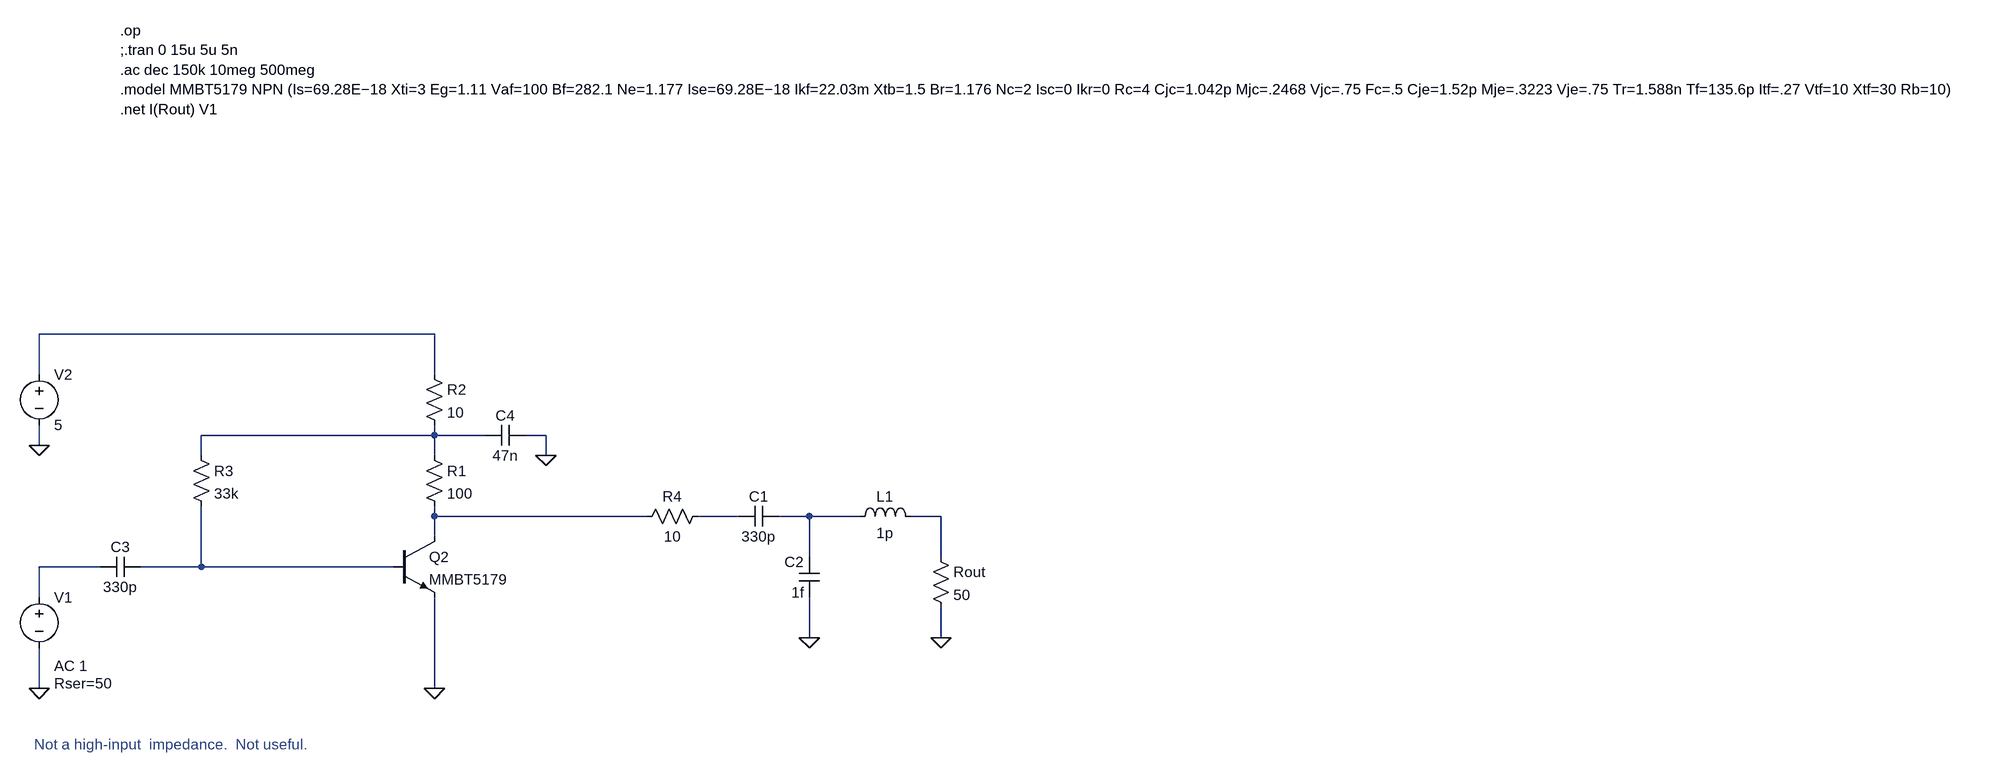
[diagram p0: schematic infineon.asc]
infineon.asc, the LTspice schematic file:
Version 4
SHEET 1 2924 680
WIRE 160 -144 -464 -144
WIRE -464 -80 -464 -144
WIRE 160 -80 160 -144
WIRE 160 16 160 0
WIRE 160 16 -208 16
WIRE 240 16 160 16
WIRE 336 16 304 16
WIRE -464 32 -464 0
WIRE -208 48 -208 16
WIRE 160 48 160 16
WIRE 336 48 336 16
WIRE 160 144 160 128
WIRE 496 144 160 144
WIRE 640 144 576 144
WIRE 752 144 704 144
WIRE 832 144 752 144
WIRE 960 144 912 144
WIRE 160 176 160 144
WIRE 752 208 752 144
WIRE 960 208 960 144
WIRE -368 224 -464 224
WIRE -208 224 -208 128
WIRE -208 224 -304 224
WIRE 96 224 -208 224
WIRE -464 272 -464 224
WIRE 752 336 752 272
WIRE 960 336 960 288
WIRE -464 416 -464 352
WIRE 160 416 160 272
FLAG -464 32 0
FLAG -464 416 0
FLAG 160 416 0
FLAG 752 336 0
FLAG 960 336 0
FLAG 336 48 0
DATAFLAG -48 224 ""
DATAFLAG 336 144 ""
DATAFLAG 64 16 ""
SYMBOL res 144 32 R0
SYMATTR InstName R1
SYMATTR Value 100
SYMBOL res 144 -96 R0
SYMATTR InstName R2
SYMATTR Value 10
SYMBOL res -224 32 R0
SYMATTR InstName R3
SYMATTR Value 33k
SYMBOL res 592 128 R90
WINDOW 0 0 56 VBottom 2
WINDOW 3 32 56 VTop 2
SYMATTR InstName R4
SYMATTR Value 10
SYMBOL cap 704 128 R90
WINDOW 0 0 32 VBottom 2
WINDOW 3 32 32 VTop 2
SYMATTR InstName C1
SYMATTR Value 330p
SYMBOL cap 768 272 R180
WINDOW 0 24 56 Left 2
WINDOW 3 24 8 Left 2
SYMATTR InstName C2
SYMATTR Value 1f
SYMBOL ind 816 160 R270
WINDOW 0 32 56 VTop 2
WINDOW 3 5 56 VBottom 2
SYMATTR InstName L1
SYMATTR Value 1p
SYMBOL res 944 192 R0
SYMATTR InstName Rout
SYMATTR Value 50
SYMBOL cap -304 208 R90
WINDOW 0 0 32 VBottom 2
WINDOW 3 32 32 VTop 2
SYMATTR InstName C3
SYMATTR Value 330p
SYMBOL voltage -464 256 R0
WINDOW 123 24 124 Left 2
WINDOW 39 24 152 Left 2
SYMATTR InstName V1
SYMATTR Value ""
SYMATTR Value2 AC 1
SYMATTR SpiceLine Rser=50
SYMBOL voltage -464 -96 R0
SYMATTR InstName V2
SYMATTR Value 5
SYMBOL cap 304 0 R90
WINDOW 0 0 32 VBottom 2
WINDOW 3 32 32 VTop 2
SYMATTR InstName C4
SYMATTR Value 47n
SYMBOL npn 96 176 R0
SYMATTR InstName Q2
SYMATTR Value MMBT5179
TEXT -336 -624 Left 2 !.op\n;.tran 0 15u 5u 5n\n.ac dec 150k 10meg 500meg\n.model MMBT5179 NPN (Is=69.28E−18 Xti=3 Eg=1.11 Vaf=100 Bf=282.1 Ne=1.177 Ise=69.28E−18 Ikf=22.03m Xtb=1.5 Br=1.176 Nc=2 Isc=0 Ikr=0 Rc=4 Cjc=1.042p Mjc=.2468 Vjc=.75 Fc=.5 Cje=1.52p Mje=.3223 Vje=.75 Tr=1.588n Tf=135.6p Itf=.27 Vtf=10 Xtf=30 Rb=10)\n.net I(Rout) V1
TEXT -472 504 Left 2 ;Not a high-input  impedance.  Not useful.

The netlist it stands for:
* infineon.asc
R1 N002 N003 100
R2 N001 N002 10
R3 N002 N008 33k
R4 N004 N003 10
C1 N005 N004 330p
C2 0 N005 1f
L1 N005 N006 1p
Rout N006 0 50
C3 N008 N007 330p
V1 N007 0 AC 1 Rser=50
V2 N001 0 5
C4 0 N002 47n
Q2 N003 N008 0 0 MMBT5179
.model NPN NPN
.model PNP PNP
.lib standard.bjt
.op
;.tran 0 15u 5u 5n
.ac dec 150k 10meg 500meg
.model MMBT5179 NPN (Is=69.28E−18 Xti=3 Eg=1.11 Vaf=100 Bf=282.1 Ne=1.177 Ise=69.28E−18 Ikf=22.03m Xtb=1.5 Br=1.176 Nc=2 Isc=0 Ikr=0 Rc=4 Cjc=1.042p Mjc=.2468 Vjc=.75 Fc=.5 Cje=1.52p Mje=.3223 Vje=.75 Tr=1.588n Tf=135.6p Itf=.27 Vtf=10 Xtf=30 Rb=10)
.net I(Rout) V1
* Not a high-input  impedance.  Not useful.
.backanno
.end